# EAGLE design tc4-controller-03 (EAGLE 5.10)
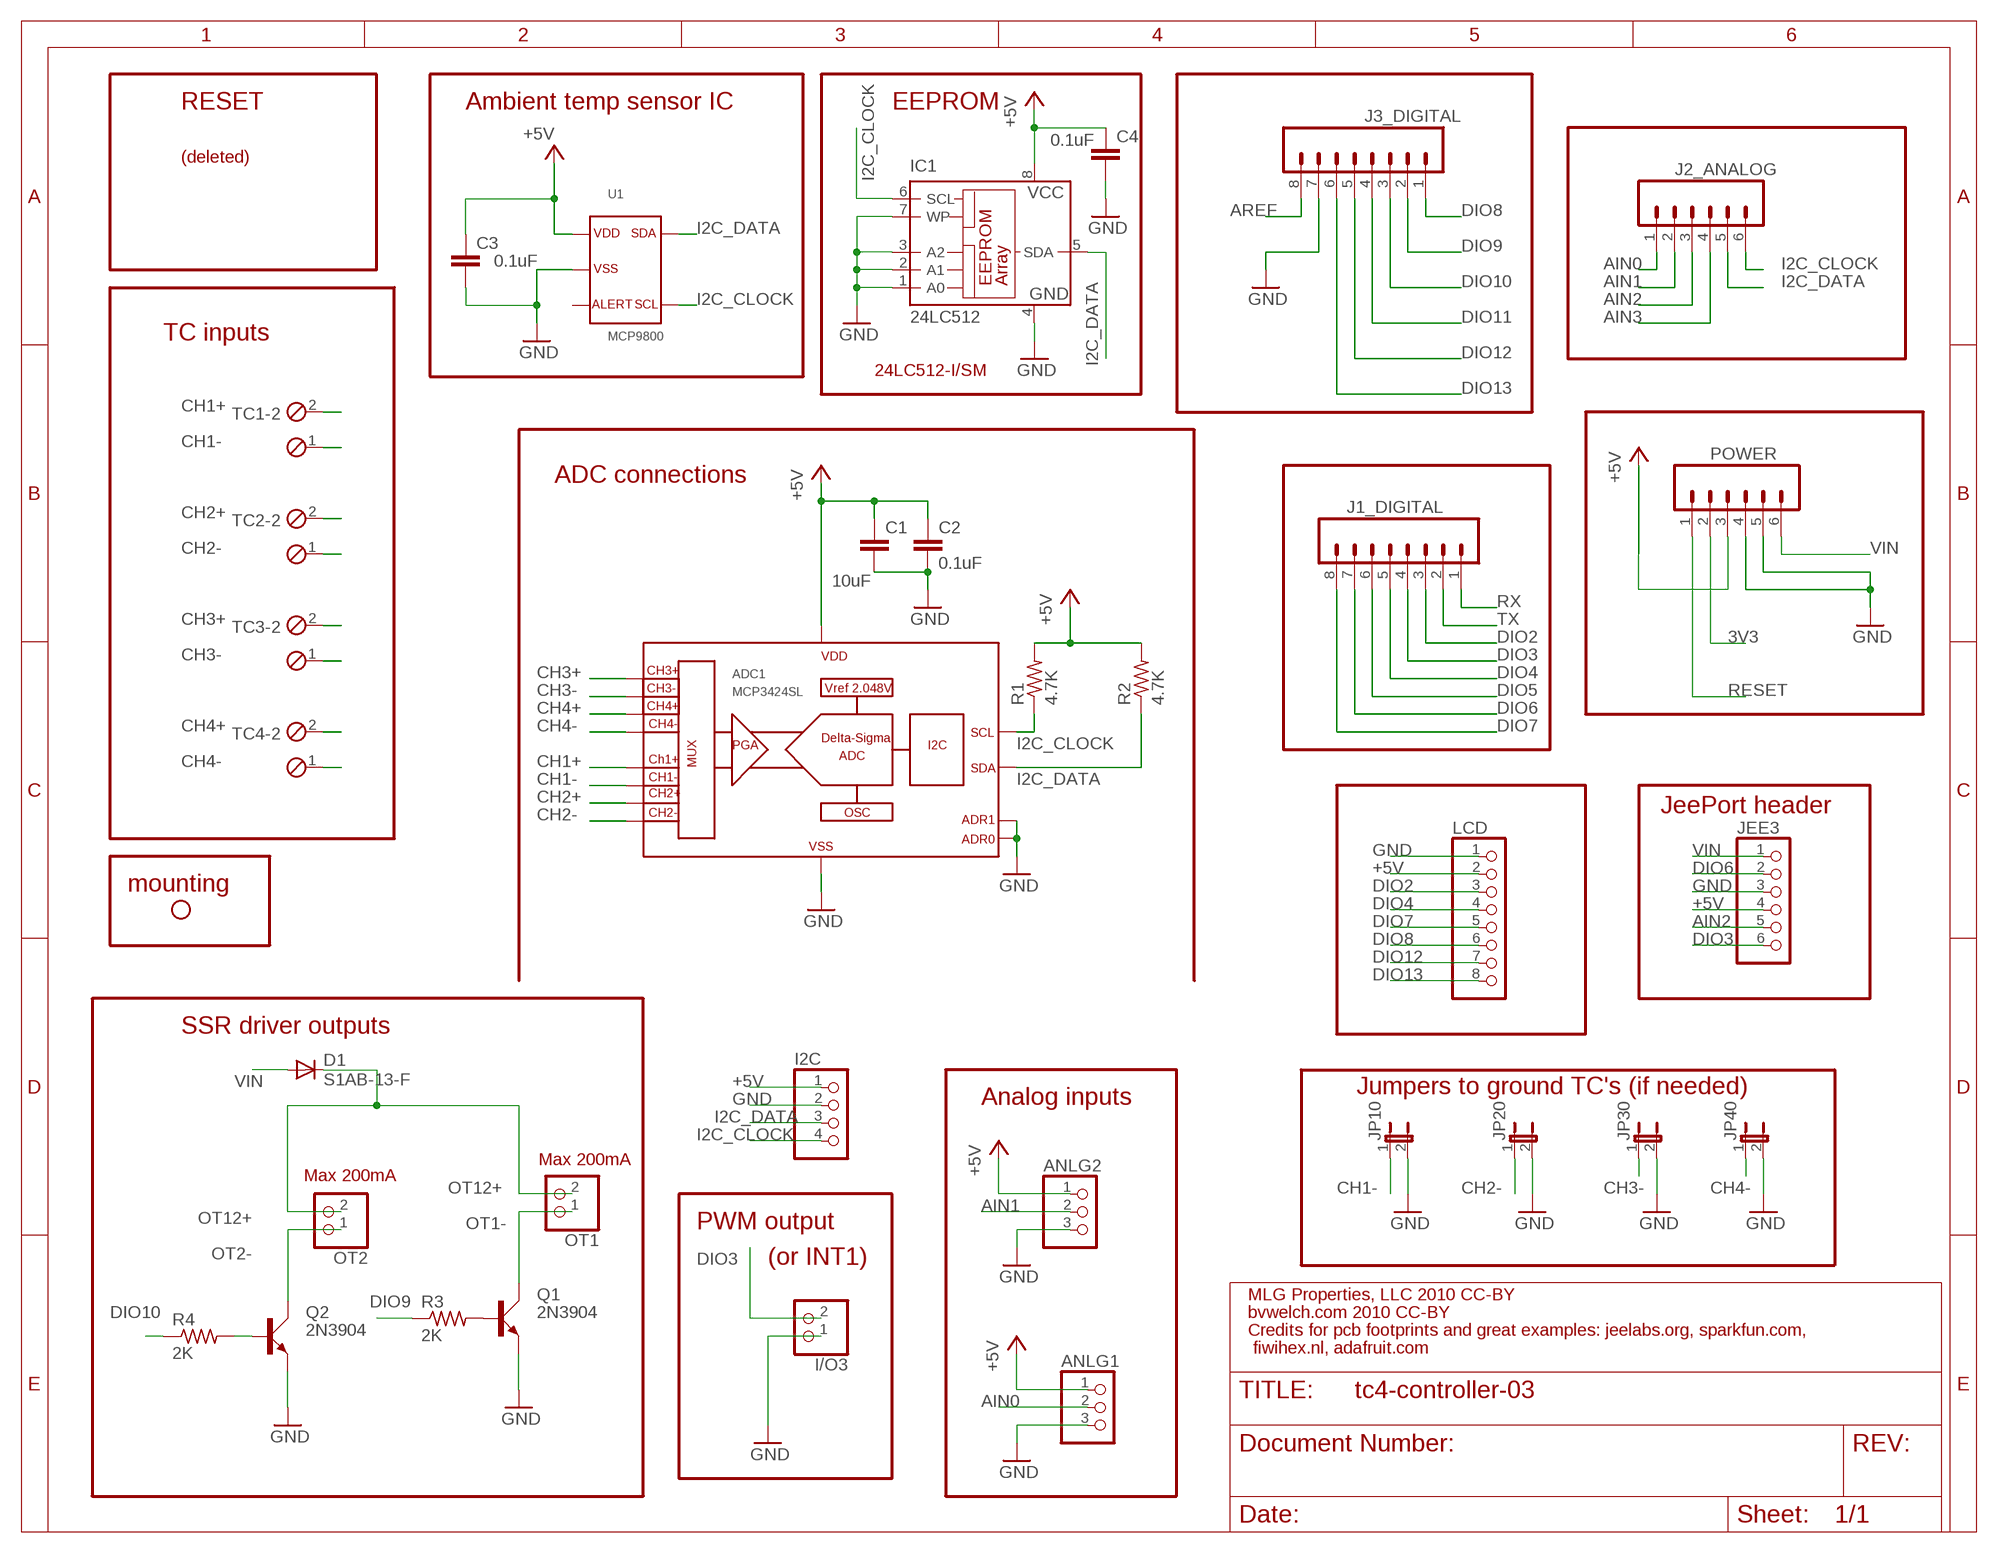
[diagram p0: schematic, sheet 1]

## Parts
ADC1  MCP3424SL  [SO14]
ANLG1  PINHD-1X3  [1X03]
ANLG2  PINHD-1X3  [1X03]
C1  10uF  C-EUC1206  [C1206]
C2  0.1uF  C-EU025-025X050  [C025-025X050]
C3  0.1uF  C-EU025-025X050  [C025-025X050]
C4  0.1uF  C-EUC1206  [C1206]
D1  S1AB-13-F  DIODE-DO214AA  [DO214AA]
I2C  PINHD-1X4  [1X04]
I/O3  PINHD-1X2  [1X02]
IC1  24LC512  24LC128SM  [SO-08M]
J1_DIGITAL  M08  [1X08]
J2_ANALOG  M06SIP  [1X06]
J3_DIGITAL  M08  [1X08]
JEE3  PINHD-1X6  [1X06]
JP2  STAND-OFF  [STAND-OFF]
JP10  JP1E  [JP1]
JP20  JP1E  [JP1]
JP30  JP1E  [JP1]
JP40  JP1E  [JP1]
LCD  PINHD-1X8  [1X08]
OT1  PINHD-1X2  [1X02]
OT2  PINHD-1X2  [1X02]
POWER  M06SIP  [1X06]
Q1  2N3904  [TO92D]
Q2  2N3904  [TO92D]
R1  4.7K  R-US_0204/7  [0204/7]
R2  4.7K  R-US_0204/7  [0204/7]
R3  2K  R-US_R1206  [R1206]
R4  2K  R-US_R1206  [R1206]
TC1  MPT2  [2POL254]
TC2  MPT2  [2POL254]
TC3  MPT2  [2POL254]
TC4  MPT2  [2POL254]
U1  MCP9800  [SOT23-5L]

## Nets
3V3: POWER.2
+5V: ADC1.6 ANLG1.1 ANLG2.1 C1.1 C2.1 C3.1 C4.1 I2C.1 IC1.8(VCC) JEE3.4 LCD.2 POWER.3 R1.2 R2.2 U1.1
AIN0: ANLG1.2 J2_ANALOG.1
AIN1: ANLG2.2 J2_ANALOG.2
AIN2: J2_ANALOG.3 JEE3.5
AIN3: J2_ANALOG.4
AREF: J3_DIGITAL.8
CH1+: ADC1.1 TC1.2
CH1-: ADC1.2 JP10.1 TC1.1
CH2+: ADC1.3 TC2.2
CH2-: ADC1.4 JP20.1 TC2.1
CH3+: ADC1.11 TC3.2
CH3-: ADC1.12 JP30.1 TC3.1
CH4+: ADC1.13 TC4.2
CH4-: ADC1.14 JP40.1 TC4.1
DIO2: J1_DIGITAL.3 LCD.3
DIO3: I/O3.2 J1_DIGITAL.4 JEE3.6
DIO4: J1_DIGITAL.5 LCD.4
DIO5: J1_DIGITAL.6
DIO6: J1_DIGITAL.7 JEE3.2
DIO7: J1_DIGITAL.8 LCD.5
DIO8: J3_DIGITAL.1 LCD.6
DIO9: J3_DIGITAL.2 R3.1
DIO10: J3_DIGITAL.3 R4.1
DIO11: J3_DIGITAL.4
DIO12: J3_DIGITAL.5 LCD.7
DIO13: J3_DIGITAL.6 LCD.8
GND: ADC1.5 ADC1.9 ADC1.10 ANLG1.3 ANLG2.3 C1.2 C2.2 C3.2 C4.2 I2C.2 I/O3.1 IC1.1(A0) IC1.2(A1) IC1.3(A2) IC1.4(GND) IC1.7(WP) J3_DIGITAL.7 JEE3.3 JP10.2 JP20.2 JP30.2 JP40.2 LCD.1 POWER.4 POWER.5 Q1.E Q2.E U1.2
I2C_CLOCK: ADC1.8 I2C.4 IC1.6(SCL) J2_ANALOG.6 R1.1 U1.4
I2C_DATA: ADC1.7 I2C.3 IC1.5(SDA) J2_ANALOG.5 R2.1 U1.5
N$3: Q2.B R4.2
N$4: Q1.B R3.2
OT1-: OT1.1 Q1.C
OT2-: OT2.1 Q2.C
OT12+: D1.C OT1.2 OT2.2
RESET: POWER.1
RX: J1_DIGITAL.1
TX: J1_DIGITAL.2
VIN: D1.A JEE3.1 POWER.6
Unconnected: U1.3

## Notes on the sheet
- RESET | Ambient temp sensor IC | EEPROM
- (deleted)
- TC inputs
- 24LC512-I/SM
- ADC connections
- JeePort header
- mounting
- SSR driver outputs
- Jumpers to ground TC's (if needed)
- Analog inputs
- Max 200mA
- Max 200mA
- PWM output
- (or INT1)
- MLG Properties, LLC 2010 CC-BY
- bvwelch.com 2010 CC-BY
- Credits for pcb footprints and great examples: jeelabs.org, sparkfun.com,
- fiwihex.nl, adafruit.com

## Library data of the parts
ADC1 = newparts_2010:MCP3424: 18-bit multi-channel delta-sigma AD converter with I2C interface. Microchip. Farnell 1630424
ANLG1 ANLG2 = pinhead:PINHD-1X3: PIN HEADER
C1-C4 = rcl:C-EU: CAPACITOR, European symbol
D1 = diode:DIODE-: DIODE
I2C = pinhead:PINHD-1X4: PIN HEADER
I/O3 OT1 OT2 = pinhead:PINHD-1X2: PIN HEADER
IC1 = microchip:24*: Serial EEPROM I2C
J1_DIGITAL J3_DIGITAL = SparkFun:M08: Header 8 Standard 8-pin 0.1" header. Use with straight break away headers (SKU : PRT-00116), right angle break away headers (PRT-00553), swiss pins (PRT-00743), machine pins (PRT-00117), and female headers (PRT-00115).
J2_ANALOG POWER = SparkFun:M06: Header 6 Standard 6-pin 0.1" header. Use with straight break away headers (SKU : PRT-00116), right angle break away headers (PRT-00553), swiss pins (PRT-00743), machine pins (PRT-00117), and female headers (PRT-00115). Molex polarized connector foot print use with SKU : PRT-08094 with associated crimp pins and housings. NOTES ON THE VARIANTS LOCK and LOCK_LONGPADS... This footprint was designed to help hold the alignment of a through-hole component (i.e. 6-pin header) while soldering it into place. You may notice that each hole has been shifted either up or down by 0.005 of an inch from it's more standard position (which is a perfectly straight line). This slight alteration caused the pins (the squares in the middle) to touch the edges of the holes. Because they are alternating, it causes a "brace" to hold the component in place. 0.005 has proven to be the perfect amount of "off-center" position when using our standard breakaway headers. Although looks a little odd when you look at the bare footprint, once you have a header in there, the alteration is very hard to notice. Also, if you push a header all the way into place, it is covered up entirely on the bottom side. This idea of altering the position of holes to aid alignment will be further integrated into the Sparkfun Library for other footprints. It can help hold any component with 3 or more connection pins.
JEE3 = pinhead:PINHD-1X6: PIN HEADER
JP2 = SparkFun:STAND-OFF: Stand Off This is the mechanical footprint for a #4 phillips button head screw. Use the keepout ring to avoid running the screw head into surrounding components. SKU : PRT-00447
JP10 JP20 JP30 JP40 = jumper:JP1E: JUMPER
LCD = pinhead:PINHD-1X8: PIN HEADER
Q1 Q2 = transistor-small-signal:2N3904: NPN TRANSISTOR
R1-R4 = rcl:R-US_: RESISTOR, American symbol
TC1-TC4 = newparts_2006:MPT2: PHOENIX CONNECTOR
U1 = newparts_2010:MCP9800: Temperature sensor I2C output, Microchip. Farnell 1439485

## Board
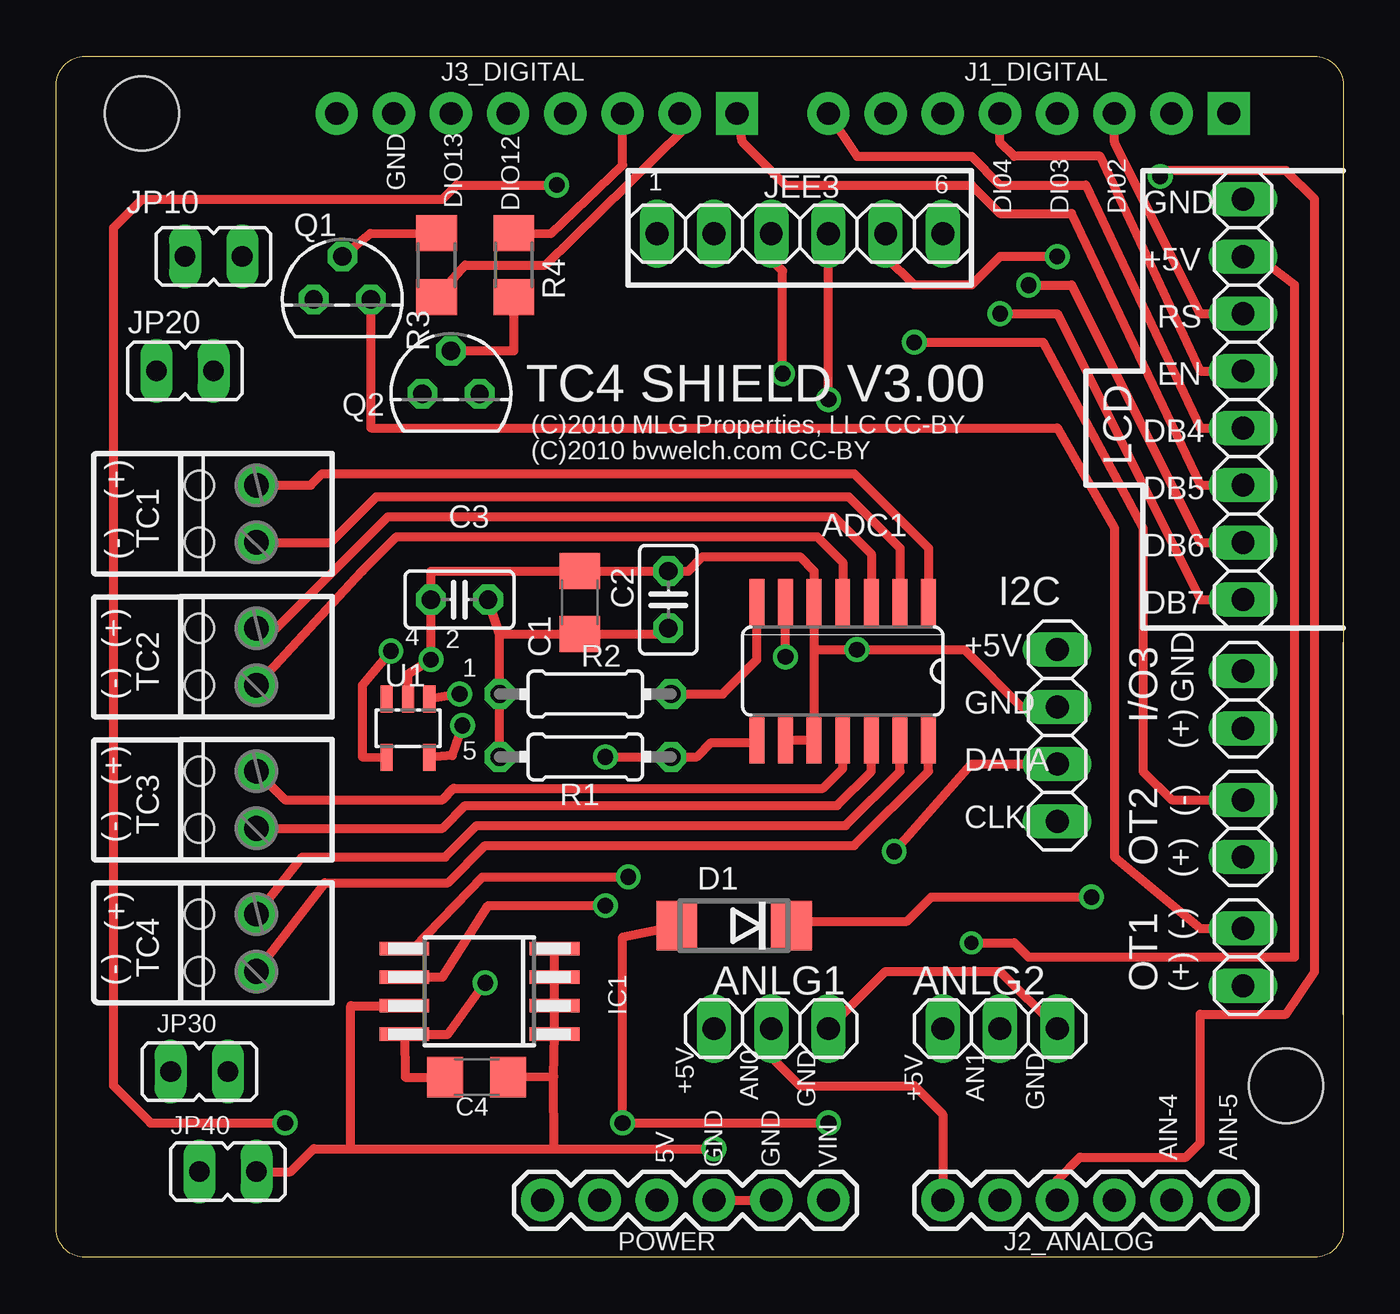
[diagram p1: board, top side]
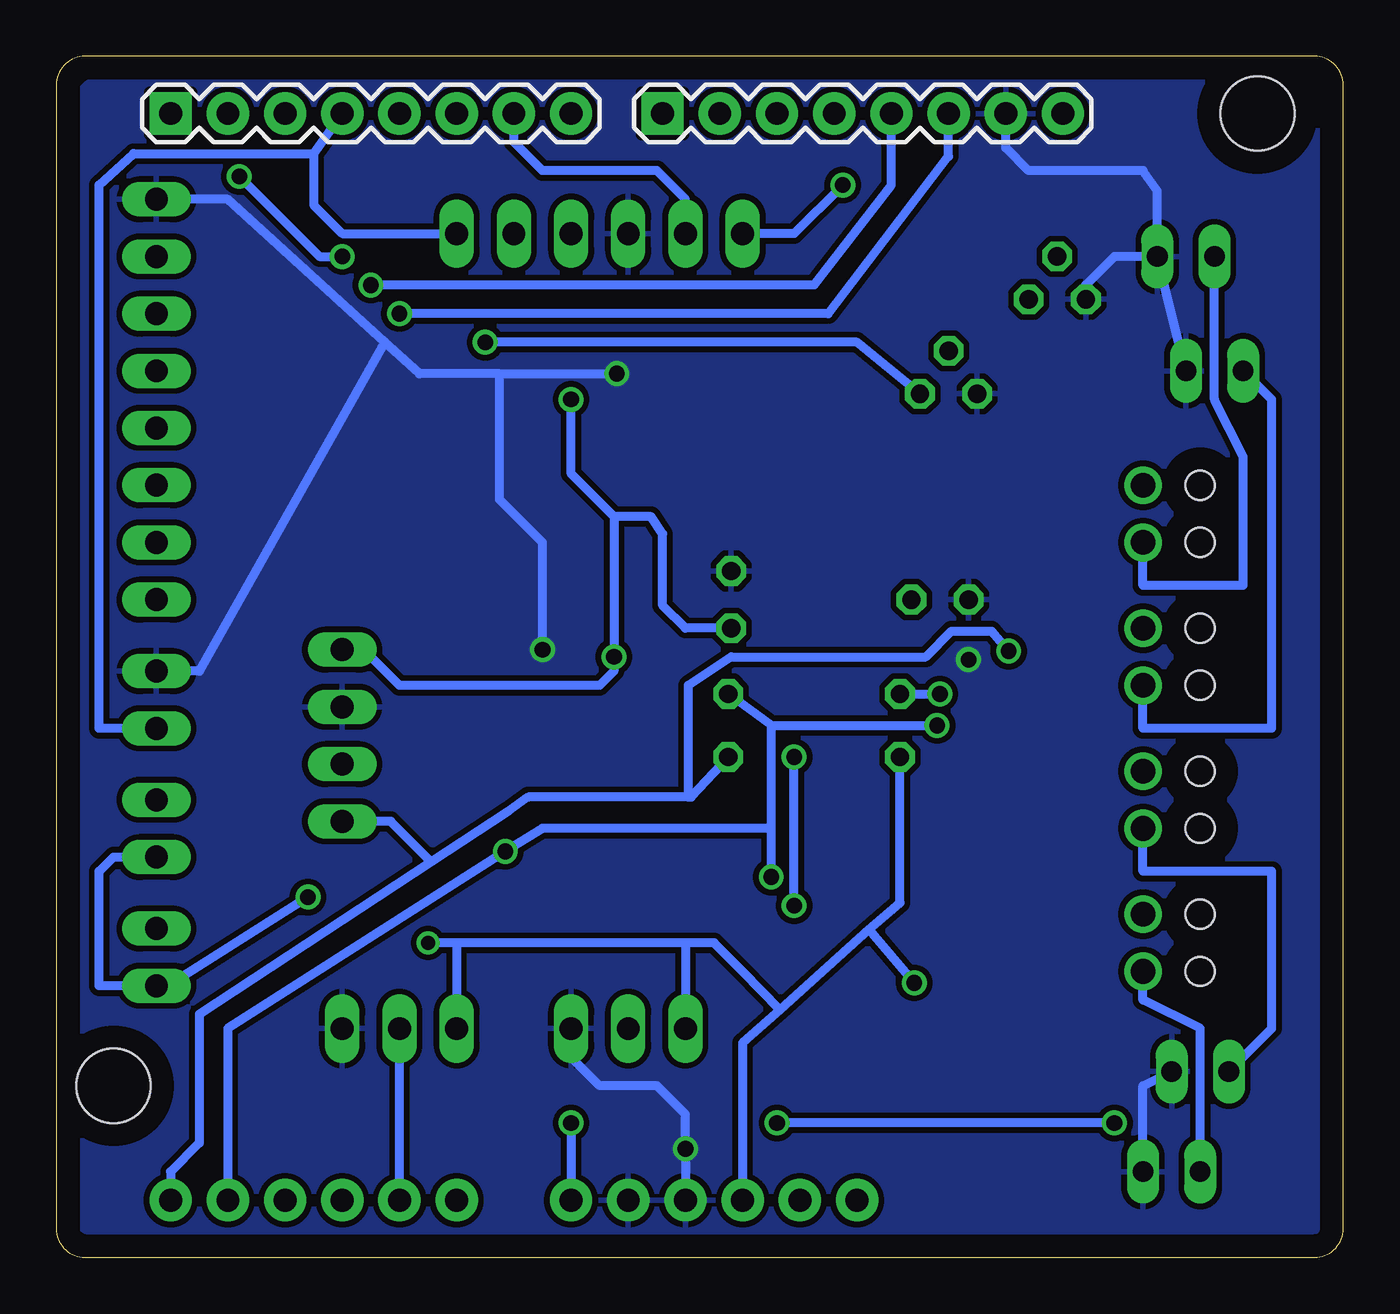
[diagram p2: board, bottom side, seen from below]

Size 57.15 x 53.34 mm. Coordinates in mm from the lower left corner, seen from the top.
Outline: 1.27,0 arc-90 0,1.27 0,52.07 arc-90 1.27,53.34 55.88,53.34 arc-90 57.15,52.07 57.15,1.27 arc-90 55.88,0 1.27,0
Copper layers (1*16): Top 0.035mm / dielectric 1.5mm / Bottom 0.035mm
Design rules "Olimex10mils": minimum track width 10mil, minimum drill 24mil, track to track 10mil, track to pad 10mil, pad to pad 10mil, via to via 10mil, smd to smd 10mil, copper to edge 40mil, drill to drill 10mil, minimum pad ring 10mil, minimum via ring 8mil, stop-mask expansion 0mil, vias tented up to drill 0mil, thermal gap 10mil

### Footprints (pad centres in the part's own frame; a part is rotated, then mirrored left to right if it is on the bottom)
SO14 = smd 0.66 x 2.032: 1 -3.81,-3.073; 2 -2.54,-3.073; 3 -1.27,-3.073; 4 0,-3.073; 5 1.27,-3.073; 6 2.54,-3.073; 7 3.81,-3.073; 8 3.81,3.073; 9 2.54,3.073; 10 1.27,3.073; 11 0,3.073; 12 -1.27,3.073; 13 -2.54,3.073; 14 -3.81,3.073
1X03 = drill 1.016 long: 1 -2.54,0; 2 0,0; 3 2.54,0
C1206 = smd 1.6 x 1.8: 1 -1.4,0; 2 1.4,0
C025-025X050 = drill 0.813 octagon: 1 -1.27,0; 2 1.27,0
DO214AA = smd 1.8 x 2.2: A 2.55,0; C -2.55,0
1X04 = drill 1.016 long: 1 -3.81,0; 2 -1.27,0; 3 1.27,0; 4 3.81,0
1X02 = drill 1.016 long: 1 -1.27,0; 2 1.27,0
SO-08M = smd 0.6 x 2.2: 1 -1.905,-3.33; 2 -0.635,-3.33; 3 0.635,-3.33; 4 1.905,-3.33; 5 1.905,3.33; 6 0.635,3.33; 7 -0.635,3.33; 8 -1.905,3.33
1X08 = drill 1.016 pad 1.88 square: 1 0,0 | drill 1.016 pad 1.88 round: 2 2.54,0; 3 5.08,0; 4 7.62,0; 5 10.16,0; 6 12.7,0; 7 15.24,0; 8 17.78,0
1X06 = drill 1.016 pad 1.88 round: 1 0,0; 2 2.54,0; 3 5.08,0; 4 7.62,0; 5 10.16,0; 6 12.7,0
1X06' = drill 1.016 long: 1 -6.35,0; 2 -3.81,0; 3 -1.27,0; 4 1.27,0; 5 3.81,0; 6 6.35,0
STAND-OFF = hole 3.302: 0,0
JP1 = drill 0.914 long: 1 0,-1.27; 2 0,1.27
1X08' = drill 1.016 long: 1 -8.89,0; 2 -6.35,0; 3 -3.81,0; 4 -1.27,0; 5 1.27,0; 6 3.81,0; 7 6.35,0; 8 8.89,0
TO92D = drill 0.813 octagon: B 0,1.905; C 1.27,0; E -1.27,0
0204/7 = drill 0.813 octagon: 1 -3.81,0; 2 3.81,0
R1206 = smd 1.6 x 1.803: 1 -1.422,0; 2 1.422,0
2POL254 = drill 1.092 pad 1.676 round: 1 -1.27,0; 2 1.27,0 | hole 1.295: -1.27,2.54; 1.27,2.54
SOT23-5L = smd 0.55 x 1.2: 1 -0.95,-1.3; 2 0,-1.3; 3 0.95,-1.3; 4 0.95,1.3; 5 -0.95,1.3

### Placement (x,y rotation side)
ADC1  34.92,26.04 180 top
ANLG1  31.75,10.16 0 top
ANLG2  41.91,10.16 0 top
C1  23.24,29.08 90 top
C2  27.18,29.21 90 top
C3  17.91,29.21 180 top
C4  18.67,8 0 top
D1  30.1,14.73 180 top
I2C  44.45,23.18 270 top
I/O3  52.71,24.77 270 top
IC1  18.8,11.81 90 top
J1_DIGITAL  52.07,50.8 0 bottom
J2_ANALOG  39.37,2.54 0 top
J3_DIGITAL  30.23,50.8 0 bottom
JEE3  [1X06']  33.02,45.47 0 top
JP1  STAND-OFF  [STAND-OFF]  54.61,7.62 180 top
JP2  3.81,50.8 180 top
JP10  6.98,44.45 270 top
JP20  5.71,39.37 270 top
JP30  6.35,8.26 270 top
JP40  7.62,3.81 270 top
LCD  [1X08']  52.71,38.1 270 top
OT1  52.71,13.34 270 top
OT2  52.71,19.05 270 top
POWER  21.59,2.54 0 top
Q1  12.7,42.55 0 top
Q2  17.53,38.35 0 top
R1  23.49,22.23 180 top
R2  23.49,25.02 180 top
R3  16.89,44.07 90 top
R4  20.32,44.07 270 top
TC1  8.89,33.02 90 top
TC2  8.89,26.67 90 top
TC3  8.89,20.32 90 top
TC4  8.89,13.97 90 top
U1  15.62,23.5 180 top

### Tracks (layer width: path | path; a pad name or v marks a point on that pad's centre or on a via)
+5V  (via drill 0.61, 0.7)
  Top 0.406: v34.29,38.1 JEE3.4 | C2.1 26.92,27.68 C1.1 21.34,27.68 19.68,27.69 | v32.38,26.67 ADC1.6 | 19.68,27.69 C3.1 | 19.68,27.69 R2.2 R1.2 | v17.91,25.02 U1.1 | v40.64,13.97 42.55,13.97 43.18,13.34 54.99,13.34 54.99,43.18 53.34,44.45 LCD.2 | v19.05,12.19 17.4,9.91 IC1.8 15.49,8 C4.1
  Bottom 0.406: POWER.3 26.67,9.53 25.02,11 | C2.1 29.21,27.94 30.23,28.96 30.23,32.13 30.73,32.89 32.38,32.89 | v34.29,38.1 34.29,34.8 32.38,32.89 | 32.38,32.89 v32.38,26.67 32.38,26.04 33.02,25.4 41.91,25.4 43.5,26.99 I2C.1 | 21.05,14.57 25.02,11 | 21.05,14.57 19.68,15.75 R1.2 | v19.05,12.19 21.05,14.57 | R2.2 v17.91,25.02 | 29.21,13.97 27.94,13.97 26.67,12.7 25.02,11 | 29.21,13.97 39.37,13.97 | 39.37,13.97 v40.64,13.97 | 29.21,13.97 ANLG1.1 | 39.37,13.97 ANLG2.1
AIN0
  Top 0.406: ANLG1.2 31.75,8.89 33.02,7.62 38.1,7.62 39.37,6.35 J2_ANALOG.1
AIN1
  Bottom 0.406: J2_ANALOG.2 ANLG2.2
AIN2  (via drill 0.7)
  Top 0.406: JEE3.5 36.83,44.45 38.1,43.18 40.64,43.18 41.91,44.45 v44.45,44.45 | J2_ANALOG.3 44.45,3.43 45.47,4.45 50.16,4.45 50.8,5.08 50.8,10.79 54.61,10.79 55.88,12.7 55.88,46.99 54.61,48.26 49.28,48.26 v49.02,48.01
  Bottom 0.406: v49.02,48.01 45.47,44.45 v44.45,44.45
CH1+
  Top 0.406: ADC1.1 38.73,31.5 35.43,34.8 11.81,34.8 11.3,34.29 TC1.2
CH1-
  Top 0.406: ADC1.2 37.47,31.5 35.18,33.78 14.22,33.78 12.19,31.75 TC1.1
  Bottom 0.406: JP10.1 5.71,38.1 4.45,35.56 4.45,29.84 8.89,29.84 TC1.1
CH2+
  Top 0.406: ADC1.3 36.2,31.24 34.54,32.89 14.73,32.89 9.78,27.94 TC2.2
CH2-
  Top 0.406: ADC1.4 34.92,30.86 33.78,32 15.11,32 13.59,30.48 TC2.1
  Bottom 0.406: TC2.1 8.89,23.5 3.18,23.5 3.18,38.1 JP20.1
CH3+
  Top 0.406: ADC1.11 34.92,21.72 34.04,20.83 17.65,20.83 17.14,20.32 10.16,20.32 TC3.2
CH3-
  Top 0.406: ADC1.12 36.2,21.59 34.67,20.07 18.16,20.07 17.14,19.05 TC3.1
  Bottom 0.406: TC3.1 8.89,17.14 3.18,17.14 3.18,10.16 JP30.1
CH4+
  Top 0.406: ADC1.13 37.47,21.59 35.05,19.18 18.67,19.18 17.27,17.78 10.92,17.78 TC4.2
CH4-
  Top 0.406: ADC1.14 38.73,21.59 35.43,18.29 19.05,18.29 17.4,16.64 11.94,16.64 TC4.1
  Bottom 0.406: JP40.1 6.35,10.16 8.89,11.43 TC4.1
DIO2
  Top 0.406: J1_DIGITAL.3 46.99,49.53 50.8,41.91 LCD.3
DIO3
  Bottom 0.406: 45.72,49.02 53.72,49.02 55.24,47.62 55.24,23.5 I/O3.2 | 45.72,49.02 J1_DIGITAL.4 | 45.72,49.02 45.72,46.74 44.45,45.47 JEE3.6
DIO4
  Top 0.406: LCD.4 50.8,39.37 46.35,48.9 42.55,48.9 41.91,49.53 J1_DIGITAL.5
DIO6
  Bottom 0.406: J1_DIGITAL.7 36.83,49.53 35.56,48.26 30.48,48.26 29.21,46.99 JEE3.2
DIO7
  Top 0.406: LCD.5 50.8,36.83 45.72,47.62 41.91,47.62 40.64,48.9 35.56,48.9 J1_DIGITAL.8
DIO8
  Top 0.406: LCD.6 50.8,34.29 45.09,46.35 41.91,46.35 40.64,47.62 32.38,47.62 30.48,49.53 J3_DIGITAL.1
DIO9
  Top 0.406: R3.1 18.16,44.07 21.72,44.07 27.81,50.04 J3_DIGITAL.2
DIO10
  Top 0.406: J3_DIGITAL.3 25.15,48.51 21.97,45.47 R4.1
DIO12  (via drill 0.7)
  Top 0.406: LCD.7 50.8,31.75 45.09,43.18 v43.18,43.18
  Bottom 0.406: J3_DIGITAL.5 20.07,47.62 23.49,43.18 v43.18,43.18
DIO13  (via drill 0.7)
  Top 0.406: LCD.8 50.8,29.21 44.45,41.91 v41.91,41.91
  Bottom 0.406: J3_DIGITAL.6 17.53,48.9 22.86,41.91 v41.91,41.91
GND  (via drill 0.7)
  Top 0.406: POWER.4 POWER.5 | ADC1.9 ADC1.10 33.66,26.99 | 33.66,26.99 ADC1.5 33.66,30.48 33.02,31.11 28.7,31.11 28.07,30.48 C2.2 C1.2 16.64,30.48 C3.2 v16.64,26.54 15.62,25.91 U1.2 | JEE3.3 31.75,44.32 32.26,43.81 v32.26,39.24 | IC1.4 IC1.3 IC1.2 IC1.1 22.08,8.02 | 33.66,26.99 v35.56,26.99 40.32,26.99 42.86,24.45 I2C.2 | JP40.2 10.41,3.81 11.43,4.83 13.08,4.83 | 13.08,4.83 22.1,4.83 | 22.1,4.83 v29.21,4.83 | 22.1,4.83 22.08,8.02 | 22.08,8.02 C4.2 | ANLG1.3 36.83,12.7 41.91,12.7 ANLG2.3 | IC1.7 13.08,11.18 13.08,4.83
  Bottom 0.406: JP20.2 JP10.2 | LCD.1 49.53,46.99 42.56,40.65 | JP30.2 8.89,7.62 JP40.2 | 37.47,39.24 41.02,39.24 42.56,40.65 | JP10.2 10.16,44.45 11.43,43.18 Q1.E | v35.56,26.99 35.56,31.75 37.47,33.66 37.47,39.24 | POWER.4 v29.21,4.83 29.21,6.35 30.48,7.62 33.02,7.62 34.29,8.89 ANLG1.3 | J3_DIGITAL.7 14.99,49.28 13.97,48.26 8.89,48.26 8.25,47.37 JP10.2 | 37.47,39.24 v32.26,39.24 | I/O3.1 50.8,26.04 42.56,40.65
  pour Bottom: 54.48,0.64 arc90 56.51,2.54 56.51,50.55 arc90 54.61,52.58 2.54,52.58 arc90 0.51,50.8 0.76,1.78 arc90 2.16,0.64
I2C_CLOCK  (via drill 0.7)
  Top 0.406: ADC1.8 31.01,22.86 29.08,22.86 28.45,22.23 R1.1 v24.38,22.23 | v24.38,15.62 19.18,15.62 17.14,12.45 IC1.6 | v14.86,26.92 13.59,25.4 13.59,22.23 U1.4
  Bottom 0.406: 40.5,17.57 37.08,19.81 36.2,20.45 29.08,20.45 | 40.5,17.57 50.8,10.79 50.8,5.08 52.07,3.81 J2_ANALOG.6 | 29.08,20.45 28.96,20.45 R1.1 | v24.38,15.62 v24.38,22.23 | 29.08,20.45 29.08,25.4 27.18,26.67 18.54,26.67 17.4,27.81 15.62,27.81 v14.86,26.92 | I2C.4 42.3,19.37 40.5,17.57
I2C_DATA  (via drill 0.7)
  Top 0.406: R2.1 29.59,25.02 31.12,26.54 ADC1.7 | U1.5 17.59,22.29 v18.03,23.62 | IC1.5 15.88,13.72 18.92,16.89 v25.4,16.89 25.46,16.83 | I2C.3 40.64,21.91 v37.21,18.03
  Bottom 0.406: J2_ANALOG.5 49.53,10.16 v37.21,18.03 35.56,19.05 25.4,19.05 | 25.4,23.62 R2.1 | 25.4,23.62 v18.03,23.62 | 25.4,19.05 25.4,23.62 | v25.4,16.89 25.4,19.05
N$3
  Top 0.406: R4.2 20.32,40.26 Q2.B
N$4
  Top 0.406: Q1.B 13.95,45.47 R3.2
OT1-
  Top 0.406: Q1.C 13.97,36.83 44.45,36.83 46.99,32.38 46.99,17.78 50.8,14.61 OT1.1
OT2-  (via drill 0.7)
  Top 0.406: OT2.1 49.53,20.32 48.26,21.59 48.26,32.38 43.81,40.64 v38.1,40.64
  Bottom 0.406: v38.1,40.64 21.59,40.64 Q2.C
OT12+  (via drill 0.7)
  Top 0.406: v45.97,16 38.86,16 37.78,14.92 32.84,14.92 D1.C
  Bottom 0.406: OT2.2 54.61,17.78 55.24,17.14 55.24,12.06 OT1.2 52.2,12.06 v45.97,16
VIN  (via drill 0.7)
  Top 0.406: v22.23,47.62 17.78,47.62 17.14,46.99 3.81,46.99 2.54,45.72 2.54,7.62 4.19,5.97 v10.16,5.97 | v34.29,5.97 v25.15,5.97 25.15,14.22 D1.A 27.42,14.61
  Bottom 0.406: JEE3.1 24.38,45.47 v22.23,47.62 | v34.29,5.97 POWER.6 | v10.16,5.97 v25.15,5.97

### Text on the board
tNames: GND | DIO13 | 1 | 6 | DIO12 | DI04 | DI03 | DI02 | GND | +5V | RS | EN | TC4 SHIELD V3.00 | (C)2010 MLG Properties, LLC CC-BY | DB4 | (C)2010 bvwelch.com CC-BY | (+) | DB5 | (-) | DB6 | DB7 | (+) | 4 | 2 | +5V | 1 | (-) | GND | GND | (+) | 5 | DATA | (+) | (-) | CLK | (-) | (+) | (+) | (-) | (-) | (+) | +5V | AN0 | GND | +5V | AN1 | GND | 5V | GND | GND | VIN | AIN-4 | AIN-5